# Altium schematic sheet RFID.SCHDOC
size A4
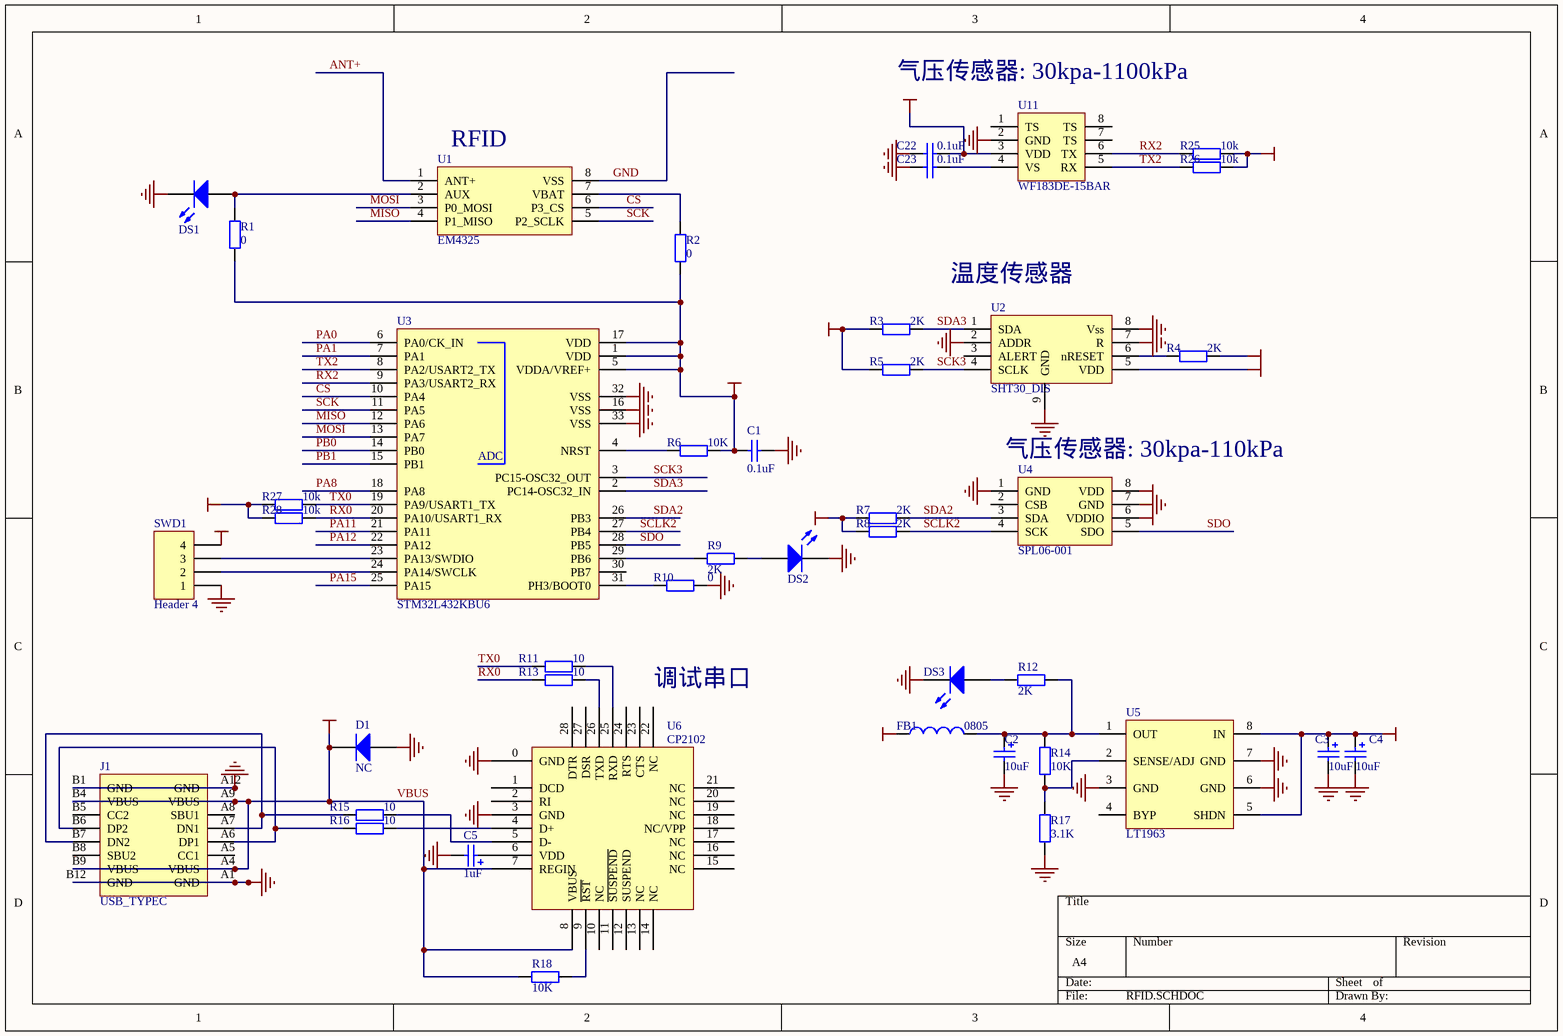
[diagram p0: RFID.SCHDOC]

## Parts
C1  0.1uF  [0805]
C2  10uF  [1206]
C3  10uF  [1206]
C4  10uF  [1206]
C5  1uF  [0805]
C22  0.1uF  [0805]
C23  0.1uF  [0805]
D1  NC  [DFLS240L]
DS1  LED  [0603]  (value not drawn)
DS2  LED  [0603]  (value not drawn)
DS3  LED  [0603]  (value not drawn)
FB1  value 0805  [0805]  (hidden comment: Inductor)
J1  USB_TYPEC  [USB_TYPEC_16]
R1  0  [0603]
R2  0  [0603]
R3  2K  [0603]
R4  2K  [0603]
R5  2K  [0603]
R6  10K  [0603]
R7  2K  [0603]
R8  2K  [0603]
R9  2K  [0603]
R10  0  [0603]
R11  10  [0603]
R12  2K  [0603]
R13  10  [0603]
R14  10K  [0603]
R15  10  [0603]
R16  10  [0603]
R17  3.1K  [0603]
R18  10K  [0603]
R25  10k  [0603]
R26  10k  [0603]
R27  10k  [0603]
R28  10k  [0603]
SWD1  Header 4  [HDR1X4]
U1  EM4325  [EM4325]
U2  SHT30_DIS  [SHT30]
U3  STM32L432KBU6  [STM32L432KBU6]
U4  SPL06-001  [SPL06-001]
U5  LT1963  [AT24C64]
U6  CP2102  [CP2102]
U11  WF183DE-15BAR  [WF183D]

## Nets
GND: C1.1 C2.2 C3.2 C4.2 C5.2 C22.1 C23.1 D1.1(A) DS1.2(K) DS2.2(K) DS3.2(K) J1.A1(GND) J1.A12(GND) J1.B1(GND) J1.B12(GND) R10.1 R17.1 SWD1.1 U1.8(VSS) U2.2(ADDR) U2.7(R) U2.8(Vss) U2.9(GND) U3.16(VSS) U3.32(VSS) U3.33(VSS) U4.1(GND) U4.7(GND) U5.3(GND) U5.6(GND) U5.7(GND) U6.0(GND) U6.3(GND) U11.2(GND)
VBUS: C3.1 C4.1 D1.2(K) J1.A4(VBUS) J1.A9(VBUS) J1.B4(VBUS) J1.B9(VBUS) R18.1 U5.5(SHDN) U5.8(IN) U6.7(REGIN) U6.8(VBUS)  [also labelled VCC_5V0]
VCC3V3: C1.2 C22.2 FB1.1 R1.1 R2.1 R3.1 R4.2 R5.1 R6.1 R7.1 R8.1 R25.2 R26.2 R27.1 R28.1 SWD1.4 U2.5(VDD) U3.1(VDD) U3.5(VDDA/VREF+) U3.17(VDD) U4.6(VDDIO) U4.8(VDD) U11.3(VDD)
ANT+: U1.1(ANT+)
CS: U1.6(P3_CS) U3.10(PA4)
MISO: U1.4(P1_MISO) U3.12(PA6)
MOSI: U1.3(P0_MOSI) U3.13(PA7)
PA0: U3.6(PA0/CK_IN)
PA1: U3.7(PA1)
PA8: U3.18(PA8)
PA11: U3.21(PA11)
PA12: U3.22(PA12)
PA15: U3.25(PA15)
PB0: U3.14(PB0)
PB1: U3.15(PB1)
RX0: R13.1 R28.2 U3.20(PA10/USART1_RX)
RX2: R25.1 U3.9(PA3/USART2_RX) U11.6(TX)
SCK: U1.5(P2_SCLK) U3.11(PA5)
SCK3: R5.2 U2.4(SCLK) U3.3(PC15-OSC32_OUT)
SCLK2: R8.2 U3.27(PB4) U4.4(SCK)
SDA2: R7.2 U3.26(PB3) U4.3(SDA)
SDA3: R3.2 U2.1(SDA) U3.2(PC14-OSC32_IN)
SDO: U3.28(PB5) U4.5(SDO)
TX0: R11.1 R27.2 U3.19(PA9/USART1_TX)
TX2: R26.1 U3.8(PA2/USART2_TX) U11.5(RX)
NetC2_1: C2.1 FB1.2 R12.2 R14.2 U5.1(OUT)
NetC5_1: C5.1 U6.6(VDD)
NetC23_2: C23.2 U11.4(VS)
NetDS1_1: DS1.1(A) R1.2 U1.2(AUX)
NetDS2_1: DS2.1(A) R9.1
NetDS3_1: DS3.1(A) R12.1
NetJ1_A6: J1.A6(DP1) J1.B6(DP2) R16.1
NetJ1_A7: J1.A7(DN1) J1.B7(DN2) R15.1
NetR2_2: R2.2 U1.7(VBAT)
NetR4_1: R4.1 U2.6(nRESET)
NetR6_2: R6.2 U3.4(NRST)
NetR9_2: R9.2 U3.29(PB6)
NetR10_2: R10.2 U3.31(PH3/BOOT0)
NetR11_2: R11.2 U6.25(RXD)
NetR13_2: R13.2 U6.26(TXD)
NetR14_1: R14.1 R17.2 U5.2(SENSE/ADJ)
NetR15_2: R15.2 U6.5(D-)
NetR16_2: R16.2 U6.4(D+)
NetR18_2: R18.2 U6.9(~{RST})
NetSWD1_2: SWD1.2 U3.24(PA14/SWCLK)
NetSWD1_3: SWD1.3 U3.23(PA13/SWDIO)

Not connected (* = marked no-connect by the designer): J1 A5(CC1) A8(SBU1) B5(CC2) B8(SBU2); U2 3(ALERT); U3 30(PB7); U4 2(CSB); U5 4(BYP); U6 1(DCD) 2(RI) 10(NC) 11(~{SUSPEND}) 12(SUSPEND) 13(NC) 14(NC) 15(NC) 16(NC) 17(NC) 18(NC/VPP) 19(NC) 20(NC) 21(NC) 22(NC) 23(CTS) 24(RTS) 27(DSR) 28(DTR); U11 1(TS) 7(TS) 8(TS)

## Notes on the sheet
- (near U11) 气压传感器: 30kpa-1100kPa
- (near U1) RFID
- 温度传感器
- (near U4) 气压传感器: 30kpa-110kPa
- 调试串口
- (in symbol STM32L432KBU6) ADC

## Library data of the parts
C1 C22 C23 = Cap: Capacitor; Value: 100NF; Published: 8-Jun-2000; LatestRevisionDate: 17-Jul-2002; LatestRevisionNote: Re-released for DXP Platform.; PackageReference: RAD-0.3; Publisher: Altium Limited
C2-C5 = Cap Pol1: Polarized Capacitor (Radial); Published: 8-Jun-2000; LatestRevisionDate: 17-Jul-2002; LatestRevisionNote: Re-released for DXP Platform.; PackageReference: RB7.6-15; Publisher: Altium Limited
D1 = Diode: Default Diode; Published: 8-Jun-2000; LatestRevisionDate: 17-Jul-2002; LatestRevisionNote: Re-released for DXP Platform.; PackageDocument: Sep-1996; PackageReference: SMC; Publisher: Altium Limited; Code_JEDEC: DO-214-AB
DS1-DS3 = LED: Typical BLUE SiC LED; Published: 8-Jun-2000; LatestRevisionDate: 17-Dec-2003; LatestRevisionNote: PCB Footprint replaced.; Publisher: Altium Limited
FB1 = Inductor: Code_IEC: 1005; Published: 8-Jun-2000; LatestRevisionDate: 17-Jul-2002; LatestRevisionNote: Re-released for DXP Platform.; PackageReference: 0402-A; Publisher: Altium Limited; Code_JEITA: 0402
R1-R17 R25-R28 = Res2: Resistor; Published: 8-Jun-2000; LatestRevisionDate: 17-Jul-2002; LatestRevisionNote: Re-released for DXP Platform.; Publisher: Altium Limited
R18 = Res: Resistor; Published: 8-Jun-2000; LatestRevisionDate: 17-Jul-2002; LatestRevisionNote: Re-released for DXP Platform.; Publisher: Altium Limited
SWD1 = Header 4: Header, 4-Pin; LatestRevisionDate: 17-Jul-2002; LatestRevisionNote: Re-released for DXP Platform.; Publisher: Altium Limited
U2 = SHT30
U5 = LT1763
U11 = WF183D